# EAGLE design usb (EAGLE 5.11)
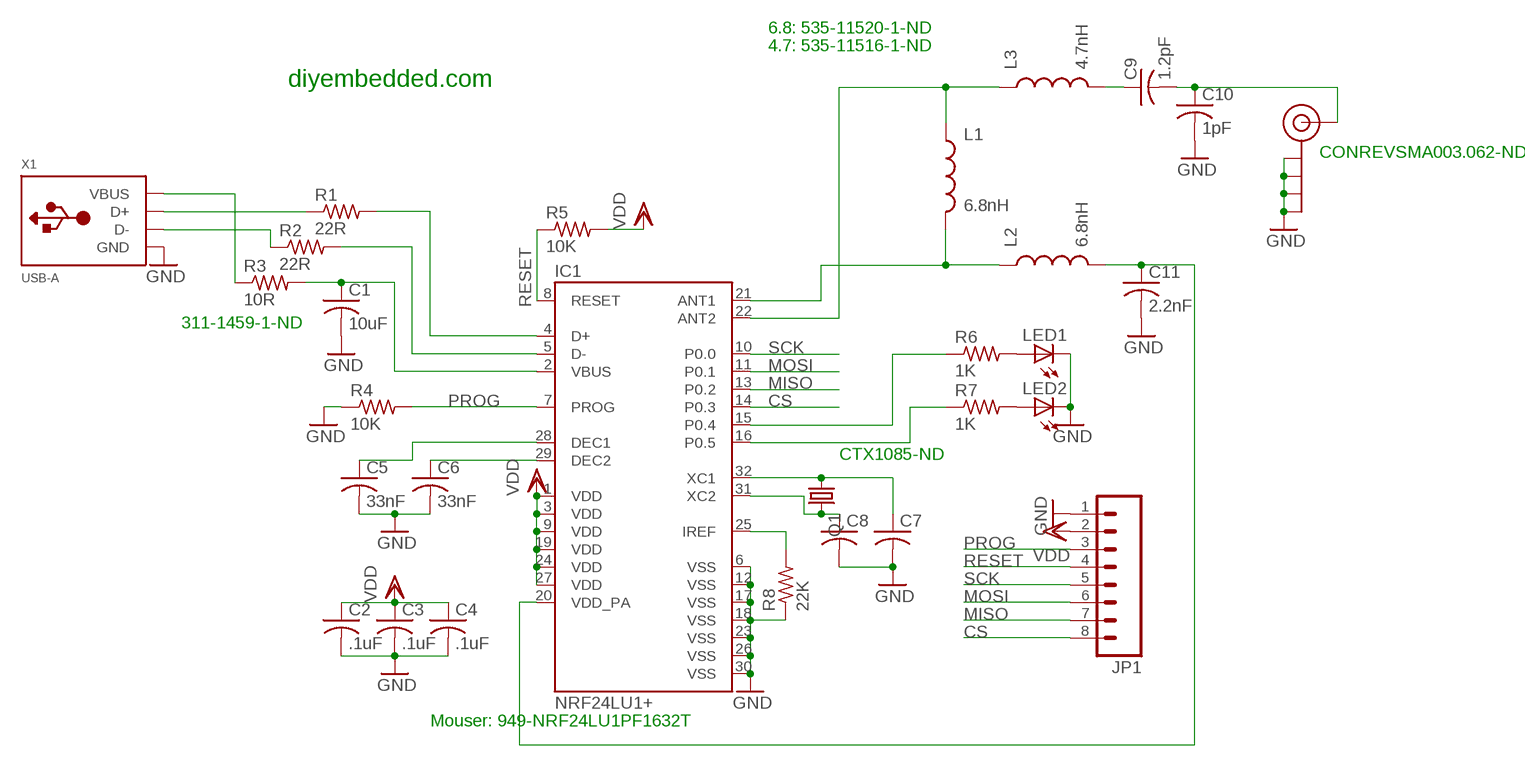
[diagram p0: schematic, sheet 1]

## Parts
C1  10uF  C-USC0805K  [C0805K]
C2  .1uF  C-USC0402  [C0402]
C3  .1uF  C-USC0402  [C0402]
C4  .1uF  C-USC0402  [C0402]
C5  33nF  C-USC0402  [C0402]
C6  33nF  C-USC0402  [C0402]
C7  C-USC0402  [C0402]
C8  C-USC0402  [C0402]
C9  1.2pF  C-USC0402  [C0402]
C10  1pF  C-USC0402  [C0402]
C11  2.2nF  C-USC0402  [C0402]
IC1  NRF24LU1+  [QFN32_5X5]
J$1  SMA_EDGE  [SMA-EDGE]
JP1  M08LOCK  [1X08_LOCK]
L1  6.8nH  INDUCTOR0402  [C0402]
L2  6.8nH  INDUCTOR0402  [C0402]
L3  4.7nH  INDUCTOR0402  [C0402]
LED1  LEDCHIP-LED0805  [CHIP-LED0805]
LED2  LEDCHIP-LED0805  [CHIP-LED0805]
Q1  CRYSTALHC49U-V  [HC49U-V]
R1  22R  R-US_R0402  [R0402]
R2  22R  R-US_R0402  [R0402]
R3  10R  R-US_R0402  [R0402]
R4  10K  R-US_R0402  [R0402]
R5  10K  R-US_R0402  [R0402]
R6  1K  R-US_R0402  [R0402]
R7  1K  R-US_R0402  [R0402]
R8  22K  R-US_R0402  [R0402]
X1  USB-A  [MOLEX_480371000]

## Nets
CS: IC1.14(P0.3) JP1.8
GND: C1.2 C2.2 C3.2 C4.2 C5.2 C6.2 C7.2 C8.2 C10.2 C11.2 IC1.6(VSS) IC1.12(VSS) IC1.17(VSS) IC1.18(VSS) IC1.23(VSS) IC1.26(VSS) IC1.30(VSS) J$1.GND@0(GND) J$1.GND@1(GND) J$1.GND@2(GND) J$1.GND@3(GND) JP1.1 LED1.C LED2.C R4.1 R8.1 X1.4(GND)
MISO: IC1.13(P0.2) JP1.7
MOSI: IC1.11(P0.1) JP1.6
N$1: R1.1 X1.3(D+)
N$2: R2.1 X1.2(D-)
N$3: IC1.4(D+) R1.2
N$4: IC1.5(D-) R2.2
N$5: R3.1 X1.1(VBUS)
N$6: C1.1 IC1.2(VBUS) R3.2
N$7: C7.1 IC1.32(XC1) Q1.1
N$8: C8.1 IC1.31(XC2) Q1.2
N$9: IC1.22(ANT2) L1.1 L3.1
N$10: C5.1 IC1.28(DEC1)
N$11: C6.1 IC1.29(DEC2)
N$12: LED1.A R6.2
N$13: LED2.A R7.2
N$14: IC1.21(ANT1) L1.2 L2.1
N$15: C9.1 L3.2
N$16: C9.2 C10.1 J$1.SIG(SIGNAL)
N$17: IC1.15(P0.4) R6.1
N$18: IC1.16(P0.5) R7.1
N$19: C11.1 IC1.20(VDD_PA) L2.2
N$21: IC1.25(IREF) R8.2
PROG: IC1.7(PROG) JP1.3 R4.2
RESET: IC1.8(RESET) JP1.4 R5.1
SCK: IC1.10(P0.0) JP1.5
VDD: C2.1 C3.1 C4.1 IC1.1(VDD) IC1.3(VDD) IC1.9(VDD) IC1.19(VDD) IC1.24(VDD) IC1.27(VDD) JP1.2 R5.2

## Notes on the sheet
- 6.8: 535-11520-1-ND
- 4.7: 535-11516-1-ND
- diyembedded.com
- CONREVSMA003.062-ND
- 311-1459-1-ND
- CTX1085-ND
- Mouser: 949-NRF24LU1PF1632T

## Library data of the parts
C1-C11 = adafruit:C-US: CAPACITOR, American symbol
IC1 = nordic:NRF24LU1+: nRF24LU1+ Single Chip 2.4 GHz Transceiver with USB Microcontroller and Flash Memory Source: nRF24LU1+ - 2.4GHz RF - Products - Nordic Semiconductor <http://www.nordicsemi.com/eng/Products/2.4GHz-RF/nRF24LU1P>
J$1 = SparkFun:SMA_EDGE: SMA Antenna Connector End launch SMA connector. The paste layer has been removed so that the connector can be hand soldered onto the board after reflow.
JP1 = SparkFun:M08: Header 8 Standard 8-pin 0.1" header. Use with straight break away headers (SKU : PRT-00116), right angle break away headers (PRT-00553), swiss pins (PRT-00743), machine pins (PRT-00117), and female headers (PRT-00115).
L1-L3 = SparkFun:INDUCTOR: Inductors Basic Inductor/Choke - 0603 and 1206. Footprints are not proven and vary greatly between part numbers.
LED1 LED2 = adafruit:LED: LED OSRAM: - CHIPLED LG R971, LG N971, LY N971, LG Q971, LY Q971, LO R971, LY R971 LH N974, LH R974 LS Q976, LO Q976, LY Q976 LO Q996 - Hyper CHIPLED LW Q18S LB Q993, LB Q99A, LB R99A - SideLED LS A670, LO A670, LY A670, LG A670, LP A670 LB A673, LV A673, LT A673, LW A673 LH A674 LY A675 LS A676, LA A676, LO A676, LY A676, LW A676 LS A679, LY A679, LG A679 - Hyper Micro SIDELED® LS Y876, LA Y876, LO Y876, LY Y876 LT Y87S - SmartLED LW L88C, LW L88S LB L89C, LB L89S, LG L890 LS L89K, LO L89K, LY L89K LS L896, LA L896, LO L896, LY L896 - TOPLED LS T670, LO T670, LY T670, LG T670, LP T670 LSG T670, LSP T670, LSY T670, LOP T670, LYG T670 LG T671, LOG T671, LSG T671 LB T673, LV T673, LT T673, LW T673 LH T674 LS T676, LA T676, LO T676, LY T676, LB T676, LH T676, LSB T676, LW T676 LB T67C, LV T67C, LT T67C, LS T67K, LO T67K, LY T67K, LW E67C LS E67B, LA E67B, LO E67B, LY E67B, LB E67C, LV E67C, LT E67C LW T67C LS T679, LY T679, LG T679 LS T770, LO T770, LY T770, LG T770, LP T770 LB T773, LV T773, LT T773, LW T773 LH T774 LS E675, LA E675, LY E675, LS T675 LS T776, LA T776, LO T776, LY T776, LB T776 LHGB T686 LT T68C, LB T68C - Hyper Mini TOPLED® LB M676 - Mini TOPLED Santana® LG M470 LS M47K, LO M47K, LY M47K Source: http://www.osram.convergy.de/
Q1 = crystal:CRYSTAL: CRYSTAL; OC_FARNELL: 1666969; OC_NEWARK: unknown
R1-R8 = adafruit:R-US_: RESISTOR, American symbol
X1 = adafruit:USB-A: USB type A 'plug' Used for things that can directly connect to a USB port, say USB key

## Board
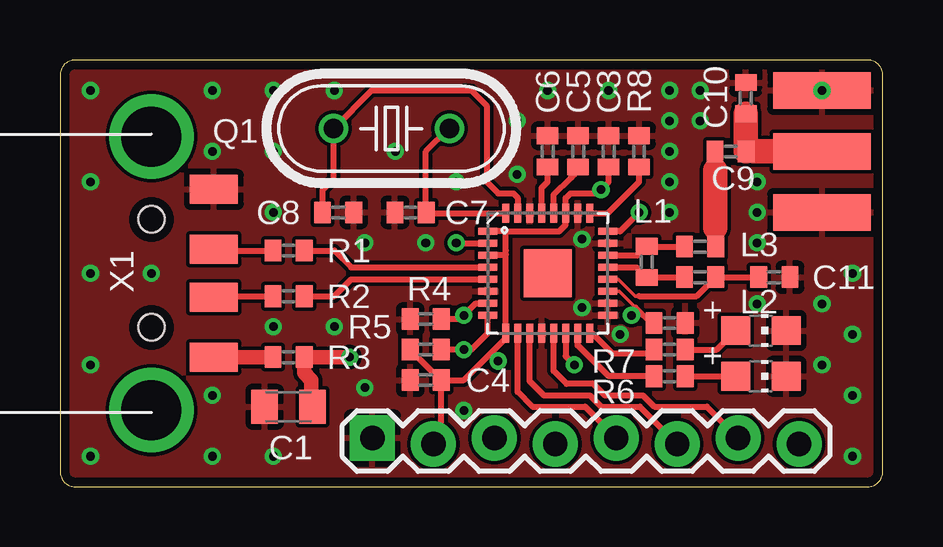
[diagram p1: board, top side]
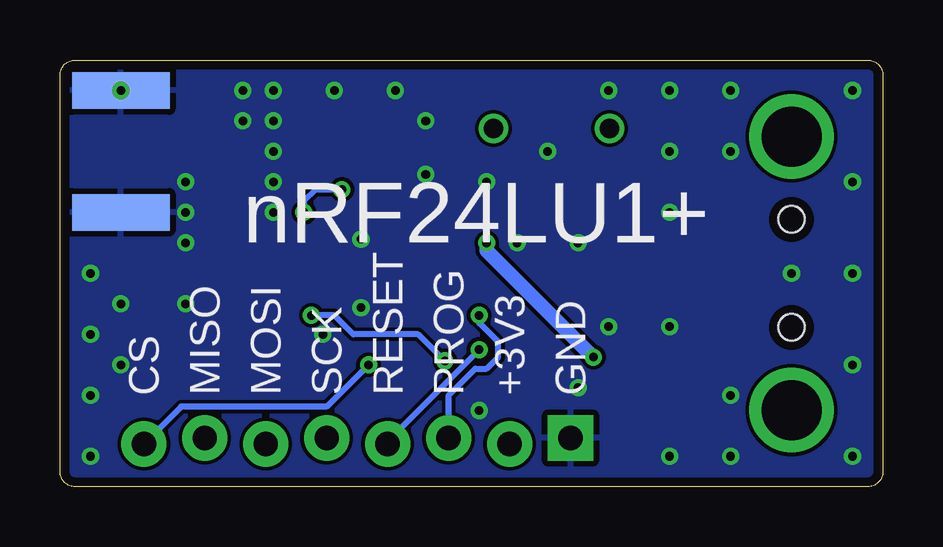
[diagram p2: board, bottom side, seen from below]

Size 34.29 x 17.78 mm. Coordinates in mm from the lower left corner, seen from the top.
Outline: 0,0.64 arc90 0.64,0 33.66,0 arc90 34.29,0.64 34.29,17.14 arc90 33.66,17.78 0.64,17.78 arc90 0,17.14 0,0.64
Copper layers (1*16): Top 0.0356mm / dielectric 1.5011mm / Bottom 0.0356mm
Design rules "LaenPCBOrder *": minimum track width 6mil, minimum drill 13mil, track to track 6mil, track to pad 6mil, pad to pad 6mil, via to via 6mil, smd to smd 6mil, copper to edge 15mil, drill to drill 6mil, minimum pad ring 7mil, minimum via ring 7mil, stop-mask expansion 4mil, vias tented up to drill 15mil, thermal gap 10mil

### Footprints (pad centres in the part's own frame; a part is rotated, then mirrored left to right if it is on the bottom)
C0805K = smd 1.1 x 1.4: 1 -1,0; 2 1,0
C0402 = smd 0.7 x 0.9: 1 -0.65,0; 2 0.65,0
QFN32_5X5 = smd 0.285 x 0.8: 1 -1.75,-2.5; 2 -1.25,-2.5; 3 -0.75,-2.5; 4 -0.25,-2.5; 5 0.25,-2.5; 6 0.75,-2.5; 7 1.25,-2.5; 8 1.75,-2.5; 17 1.75,2.5; 18 1.25,2.5; 19 0.75,2.5; 20 0.25,2.5; 21 -0.25,2.5; 22 -0.75,2.5; 23 -1.25,2.5; 24 -1.75,2.5 | smd 0.8 x 0.285: 9 2.5,-1.75; 10 2.5,-1.25; 11 2.5,-0.75; 12 2.5,-0.25; 13 2.5,0.25; 14 2.5,0.75; 15 2.5,1.25; 16 2.5,1.75; 25 -2.5,1.75; 26 -2.5,1.25; 27 -2.5,0.75; 28 -2.5,0.25; 29 -2.5,-0.25; 30 -2.5,-0.75; 31 -2.5,-1.25; 32 -2.5,-1.75 | smd 2 x 2: EP 0,0
SMA-EDGE = smd 1.524 x 4.064: GND@0 0,0; GND@1 5.08,0; SIG 2.54,0 | smd 1.524 x 4.064 bottom: GND@2 0,0; GND@3 5.08,0
1X08_LOCK = drill 1.016 pad 1.88 square: 1 0,0.127 | drill 1.016 pad 1.88 round: 2 2.54,-0.127; 3 5.08,0.127; 4 7.62,-0.127; 5 10.16,0.127; 6 12.7,-0.127; 7 15.24,0.127; 8 17.78,-0.127
CHIP-LED0805 = smd 1.2 x 1.2: A 0,-1.05; C 0,1.05
HC49U-V = drill 0.813 round: 1 -2.413,0; 2 2.413,0
R0402 = smd 0.7 x 0.9: 1 -0.65,0; 2 0.65,0
MOLEX_480371000 = smd 1.2 x 2: 1 3.5,2.6; 2 1,2.6; 3 -1,2.6; 4 -3.5,2.6 | drill 2.5 round: M1 -5.7,0; M2 5.7,0 | hole 1.1: -2.25,0; 2.25,0

### Placement (x,y rotation side)
C1  9.53,3.33 180 top
C2  25.4,6.83 0 top
C3  22.86,13.97 90 top
C4  15.24,4.45 180 top
C5  21.59,13.97 90 top
C6  20.32,13.97 90 top
C7  14.61,11.43 180 top
C8  11.59,11.43 0 top
C9  27.94,13.97 0 top
C10  28.57,16.19 90 top
C11  29.77,8.73 0 top
IC1  20.32,8.89 270 top
J$1  31.75,11.43 90 top
JP1  13.02,1.91 0 top
L1  24.45,9.37 270 top
L2  26.67,8.73 0 top
L3  26.67,10 0 top
LED1  29.21,4.6 270 top
LED2  29.21,6.51 270 top
Q1  13.81,14.92 180 top
R1  9.53,9.84 0 top
R2  9.53,7.94 0 top
R3  9.53,5.4 0 top
R4  15.24,6.99 0 top
R5  15.24,5.71 180 top
R6  25.4,4.6 0 top
R7  25.4,5.72 0 top
R8  24.13,13.97 270 top
X1  3.81,8.89 270 top

### Tracks (layer width: path | path; a pad name or v marks a point on that pad's centre or on a via)
CS  (via drill 0.36)
  Top 0.254: IC1.14 21.07,5.44 v21.43,5.08
  Bottom 0.254: v21.43,5.08 23.18,3.33 29.24,3.33 JP1.8
GND  (via drill 0.36)
  other vias: 15.24,10.16 12.7,10.16 23.34,6.35 31.75,16.51 25.4,16.51 25.4,13.97 25.4,11.43 26.67,15.24 29.05,11.43 25.4,12.7 25.4,15.24 26.67,16.51 29.05,12.7 33.02,1.27 33.02,3.81 33.02,6.35 33.02,8.89 31.75,7.62 31.75,5.08 22.86,16.51 20.32,16.51 19.05,15.24 21.75,7.46 21.75,10.32 19.05,13.02 16.83,3.17 1.27,1.27 1.27,5.08 1.27,8.89 1.27,12.7 1.27,16.51 6.35,16.51 6.35,13.97 3.81,8.89 6.35,3.81 6.35,1.27 8.89,1.27 8.89,6.67 11.43,6.67 8.89,11.43 8.89,13.97 8.89,16.51 11.43,16.51 13.97,13.97 16.51,12.7 12.7,4.13 29.05,10.16 29.05,7.62
  pour Bottom (isolate 0.152): 0,0 34.29,0 34.29,17.78 0,17.78
  pour Top (isolate 0.152): 0,0 34.29,0 34.29,17.78 0,17.78
MISO
  Top 0.254: IC1.13 20.57,4.83 21.11,4.29 22.23,4.29 22.7,3.81 24.29,3.81 24.77,3.33 26.96,3.33 JP1.7
MOSI
  Top 0.254: IC1.11 19.57,4.4 20.16,3.81 22.07,3.81 22.54,3.33 24.16,3.33 JP1.6
N$1
  Top 0.254: R1.1 6.46,9.84 X1.3
N$2
  Top 0.254: R2.1 6.46,7.94 X1.2
N$3
  Top 0.254: IC1.4 12.13,9.14 11.43,9.84 R1.2
N$4
  Top 0.254: IC1.5 12.13,8.64 11.43,7.94 R2.2
N$5
  Top 0.61: R3.1 X1.1
N$6  (via drill 0.36)
  Top 0.254: IC1.2 16.53,10.14 v16.51,10.16
  Top 0.61: C1.1 10.48,3.38 10.48,4.45 10.18,4.75 R3.2 v12.06,5.4
  Bottom 0.61: v12.06,5.4 16.51,9.84 v16.51,10.16
N$7
  Top 0.254: Q1.1 16.19,14.92 15.24,13.97 15.24,11.45 C7.1 15.29,11.39 IC1.32
N$8
  Top 0.254: C8.1 10.94,12.37 11.4,12.83 Q1.2 12.99,16.51 17.14,16.51 17.78,15.88 17.78,12.7 18.26,12.22 18.89,12.22 19.07,12.04 IC1.31
N$9
  Top 0.254: IC1.22 24.07,9.64 L1.1 24.46,10 L3.1
N$10
  Top 0.254: IC1.28 20.57,12.16 21.27,12.86 | 21.27,12.86 | 21.27,12.86 21.43,13.02 21.43,13.16 C5.1
N$11
  Top 0.254: IC1.29 20.07,12.45 20.32,12.7 C6.1
N$12
  Top 0.254: R6.2 LED1.A
N$13
  Top 0.254: R7.2 27.37,5.71 LED2.A
N$14
  Top 0.254: IC1.21 24.02,9.14 L1.2 24.46,8.73 L2.1
N$15
  Top 0.61: L3.2 27.32,10.46 27.3,10.48 27.3,10.79 | 27.3,13.18 27.3,13.96 C9.1
  Top 1.016: 27.3,10.79 27.3,13.18
N$16
  Top 0.61: C9.2 28.73,13.97
  Top 0.813: 28.73,13.97 28.89,13.97
  Top 1.016: 28.89,13.97 J$1.SIG | C10.1 28.57,13.98 C9.2
N$17
  Top 0.254: IC1.15 21.57,5.89 22.86,4.6 R6.1
N$18
  Top 0.254: R7.1 24.75,5.7 24.61,5.56 23.02,5.56 22.18,6.39 IC1.16
N$19
  Top 0.152: 24.13,7.94 23.97,7.94 23.27,8.64 IC1.20
  Top 0.254: C11.1 L2.2 26.53,7.94 24.13,7.94
N$21
  Top 0.254: IC1.25 22.82,11.39 24.13,12.7 R8.2
PROG  (via drill 0.36)
  Top 0.254: IC1.7 17.32,7.64 v16.83,7.14 16.75,7.06 16.67,6.99 R4.2 15.72,6.99
  Bottom 0.254: JP1.3 18.1,3.81 16.99,4.92 16.51,4.92 16.03,5.4 16.03,6.03 16.83,6.83 v16.83,7.14 | v16.83,7.14
RESET  (via drill 0.36)
  Top 0.254: R5.1 v16.83,5.71 17.14,5.71 17.82,6.39 IC1.8
  Bottom 0.254: JP1.4 20.64,1.91 v16.83,5.71
SCK
  Top 0.254: IC1.10 19.07,3.95 19.68,3.33 21.88,3.33 JP1.5
VDD  (via drill 0.36)
  Top 0.152: IC1.19 23.29,8.14 23.81,7.62 23.97,7.46
  Top 0.254: C3.1 22.86,12.7 v22.54,12.38 22.38,12.22 21.27,12.22 21.07,12.02 IC1.27 21.07,10.91 20.8,10.64 18.57,10.64 | 23.97,7.46 | 24.05,7.38 24.61,6.83 C2.1 | 24.05,7.38 23.97,7.46 | IC1.24 23.34,10.64 v24.13,11.43 | 18.57,10.64 IC1.1 | 18.57,10.64 18.57,9.84 18.57,9.68 | C4.1 15.89,2.11 JP1.2 | C4.1 15.86,4.45 R5.2 | 18.57,9.68 IC1.9 18.57,6.19 17.94,5.56 | IC1.3 18.53,9.64 18.57,9.68 | 17.94,5.56 16.83,4.45 C4.1 | 17.94,5.56 v18.26,5.24 | v23.81,7.14 24.05,7.38
  Bottom 0.254: v24.13,11.43 24.13,11.91 23.65,12.38 v22.54,12.38 | v18.26,5.24 19.37,6.35 22.07,6.35 22.86,7.14 v23.81,7.14

### Text on the board
bNames: nRF24LU1+ | GND | +3V3 | PROG | RESET | SCK | MOSI | MISO | CS